# Altium schematic sheet Regulators_block.SchDoc
size A3
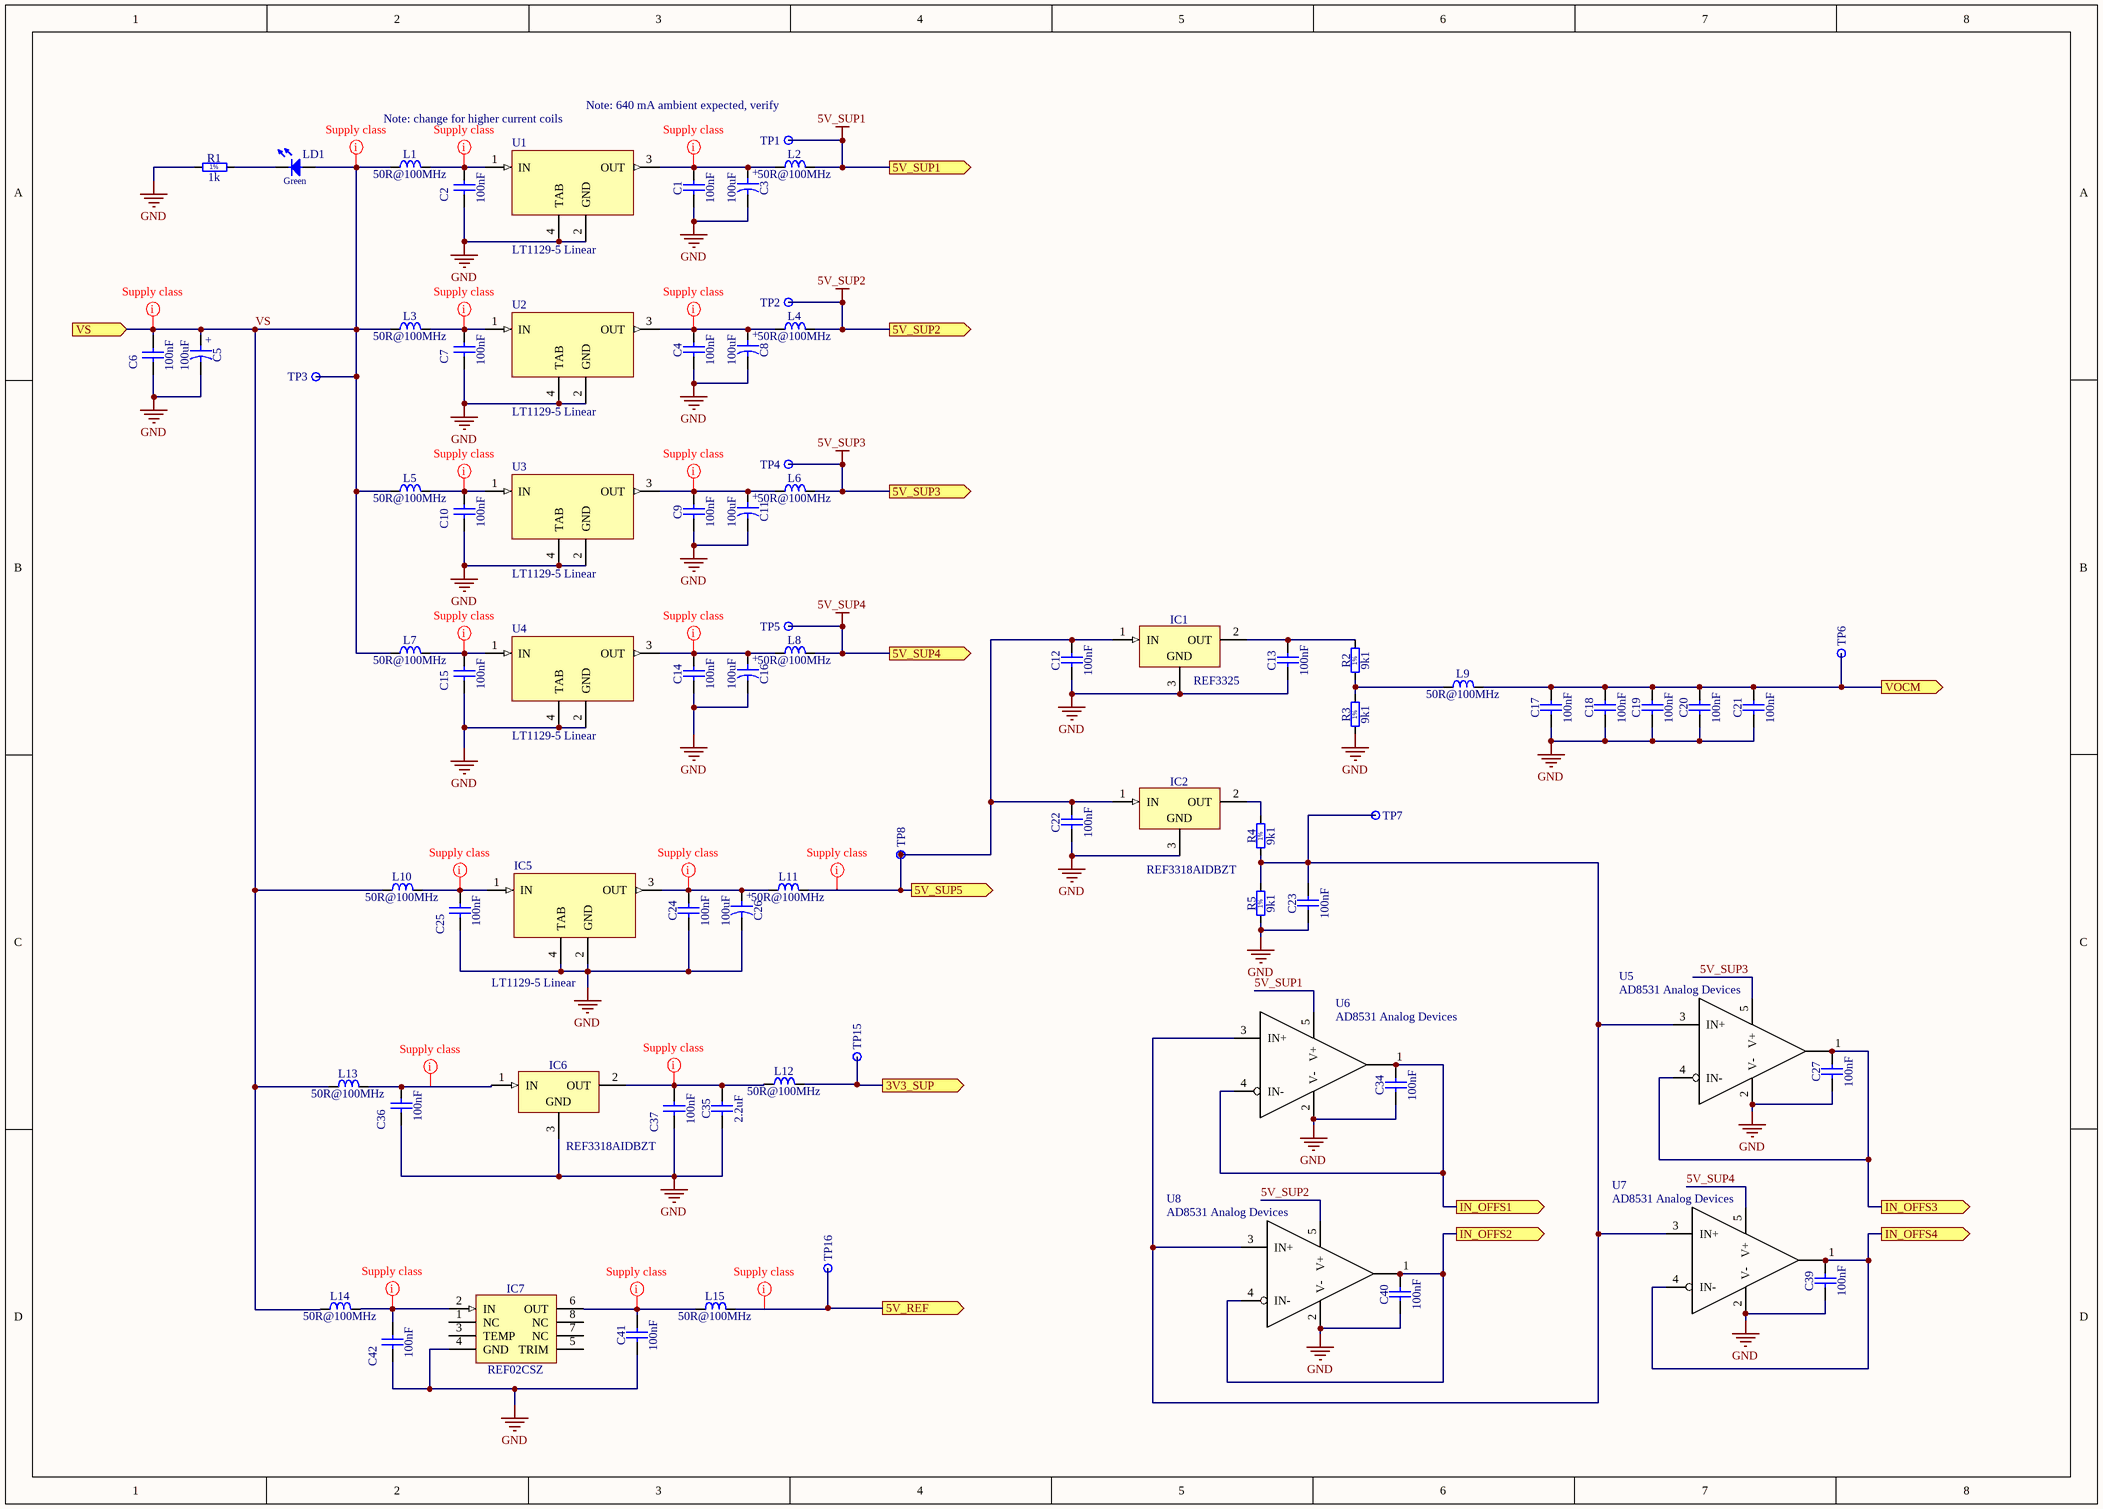
[diagram p0: Regulators_block.SchDoc]

## Parts
C1  100nF  [CAPC2012X135N]
C2  100nF  [CAPC2012X135N]
C3  100uF  [CAPAE660X540N]
C4  100nF  [CAPC2012X135N]
C5  100uF  [CAPAE660X540N]
C6  100nF  [CAPC2012X135N]
C7  100nF  [CAPC2012X135N]
C8  100uF  [CAPAE660X540N]
C9  100nF  [CAPC2012X135N]
C10  100nF  [CAPC2012X135N]
C11  100uF  [CAPAE660X540N]
C12  100nF  [CAPC2012X135N]
C13  100nF  [CAPC2012X135N]
C14  100nF  [CAPC2012X135N]
C15  100nF  [CAPC2012X135N]
C16  100uF  [CAPAE660X540N]
C17  100nF  [CAPC2012X135N]
C18  100nF  [CAPC2012X135N]
C19  100nF  [CAPC2012X135N]
C20  100nF  [CAPC2012X135N]
C21  100nF  [CAPC2012X135N]
C22  100nF  [CAPC2012X135N]
C23  100nF  [CAPC2012X135N]
C24  100nF  [CAPC2012X135N]
C25  100nF  [CAPC2012X135N]
C26  100uF  [CAPAE660X540N]
C27  100nF  [CAPC2012X135N]
C34  100nF  [CAPC2012X135N]
C35  2.2uF  [CAPC2012X135N]
C36  100nF  [CAPC2012X135N]
C37  100nF  [CAPC2012X135N]
C39  100nF  [CAPC2012X135N]
C40  100nF  [CAPC2012X135N]
C41  100nF  [CAPC2012X135N]
C42  100nF  [CAPC2012X135N]
IC1  REF3325  [SOT95P237X112-3N]
IC2  REF3318AIDBZT  [SOT95P237X112-3N]
IC5  LT1129-5 Linear  [SOT230P700X175-4N]
IC6  REF3318AIDBZT  [SOT95P237X112-3N]
IC7  REF02CSZ  [SOIC127P600X175-8N]
L1  50R@100MHz  [IND_MURATA_BLM31PG]
L2  50R@100MHz  [IND_MURATA_BLM31PG]
L3  50R@100MHz  [IND_MURATA_BLM31PG]
L4  50R@100MHz  [IND_MURATA_BLM31PG]
L5  50R@100MHz  [IND_MURATA_BLM31PG]
L6  50R@100MHz  [IND_MURATA_BLM31PG]
L7  50R@100MHz  [IND_MURATA_BLM31PG]
L8  50R@100MHz  [IND_MURATA_BLM31PG]
L9  50R@100MHz  [IND_MURATA_BLM31PG]
L10  50R@100MHz  [IND_MURATA_BLM31PG]
L11  50R@100MHz  [IND_MURATA_BLM31PG]
L12  50R@100MHz  [IND_MURATA_BLM31PG]
L13  50R@100MHz  [IND_MURATA_BLM31PG]
L14  50R@100MHz  [IND_MURATA_BLM31PG]
L15  50R@100MHz  [IND_MURATA_BLM31PG]
LD1  Green  [LED_OSRAM_LGR971]  (value not drawn)
R1  1k  [RESC2012X60N]
R2  9k1  [RESC2012X60N]
R3  9k1  [RESC2012X60N]
R4  9k1  [RESC2012X60N]
R5  9k1  [RESC2012X60N]
TP1  Test Point  [VERO_20-313145]  (value not drawn)
TP2  Test Point  [VERO_20-313145]  (value not drawn)
TP3  Test Point  [VERO_20-313145]  (value not drawn)
TP4  Test Point  [VERO_20-313145]  (value not drawn)
TP5  Test Point  [VERO_20-313145]  (value not drawn)
TP6  Test Point  [VERO_20-313145]  (value not drawn)
TP7  Test Point  [VERO_20-313145]  (value not drawn)
TP8  Test Point  [VERO_20-2136]  (value not drawn)
TP15  Test Point  [VERO_20-2136]  (value not drawn)
TP16  Test Point  [VERO_20-2136]  (value not drawn)
U1  LT1129-5 Linear  [SOT230P700X175-4N]
U2  LT1129-5 Linear  [SOT230P700X175-4N]
U3  LT1129-5 Linear  [SOT230P700X175-4N]
U4  LT1129-5 Linear  [SOT230P700X175-4N]
U5  AD8531 Analog Devices  [SOT95P285X145-5N]
U6  AD8531 Analog Devices  [SOT95P285X145-5N]
U7  AD8531 Analog Devices  [SOT95P285X145-5N]
U8  AD8531 Analog Devices  [SOT95P285X145-5N]

## Ports
3V3_SUP (out), 5V_REF (out), 5V_SUP1 (out), 5V_SUP2 (out), 5V_SUP3 (out), 5V_SUP4 (out), 5V_SUP5 (out), IN_OFFS1 (out), IN_OFFS2 (out), IN_OFFS3 (out), IN_OFFS4 (out), VOCM (out), VS (in)

## Nets
5V_SUP1: L2.2 TP1.1 U6.5(V+) ; port 5V_SUP1
5V_SUP2: L4.2 TP2.1 U8.5(V+) ; port 5V_SUP2
5V_SUP3: L6.2 TP4.1 U5.5(V+) ; port 5V_SUP3
5V_SUP4: L8.2 TP5.1 U7.5(V+) ; port 5V_SUP4
GND: C1.1 C2.1 C3.2 C4.1 C5.2 C6.1 C7.1 C8.2 C9.1 C10.1 C11.2 C12.1 C13.1 C14.1 C15.1 C16.2 C17.1 C18.1 C19.1 C20.1 C21.1 C22.1 C23.1 C24.1 C25.1 C26.2 C27.1 C34.1 C35.1 C36.1 C37.1 C39.1 C40.1 C41.1 C42.1 IC1.3(GND) IC2.3(GND) IC5.2(GND) IC5.4(TAB) IC6.3(GND) IC7.4(GND) R1.1 R3.1 R5.1 U1.2(GND) U1.4(TAB) U2.2(GND) U2.4(TAB) U3.2(GND) U3.4(TAB) U4.2(GND) U4.4(TAB) U5.2(V-) U6.2(V-) U7.2(V-) U8.2(V-)
3V3_SUP: L12.2 TP15.1 ; port 3V3_SUP
5V_REF: L15.2 TP16.1 ; port 5V_REF
5V_SUP5: C12.2 C22.2 IC1.1(IN) IC2.1(IN) L11.2 TP8.1 ; port 5V_SUP5
IN_OFFS1: C34.2 U6.1(OUT+) U6.4(IN-) ; port IN_OFFS1
IN_OFFS2: C40.2 U8.1(OUT+) U8.4(IN-) ; port IN_OFFS2
IN_OFFS3: C27.2 U5.1(OUT+) U5.4(IN-) ; port IN_OFFS3
IN_OFFS4: C39.2 U7.1(OUT+) U7.4(IN-) ; port IN_OFFS4
VOCM: C17.2 C18.2 C19.2 C20.2 C21.2 L9.2 TP6.1 ; port VOCM
VS: C5.1 C6.2 L1.1 L3.1 L5.1 L7.1 L10.1 L13.1 L14.1 LD1.2(A) TP3.1 ; port VS
NetC1_2: C1.2 C3.1 L2.1 U1.3(OUT)
NetC2_2: C2.2 L1.2 U1.1(IN)
NetC4_2: C4.2 C8.1 L4.1 U2.3(OUT)
NetC7_2: C7.2 L3.2 U2.1(IN)
NetC9_2: C9.2 C11.1 L6.1 U3.3(OUT)
NetC10_2: C10.2 L5.2 U3.1(IN)
NetC13_2: C13.2 IC1.2(OUT) R2.2
NetC14_2: C14.2 C16.1 L8.1 U4.3(OUT)
NetC15_2: C15.2 L7.2 U4.1(IN)
NetC23_2: C23.2 R4.1 R5.2 TP7.1 U5.3(IN+) U6.3(IN+) U7.3(IN+) U8.3(IN+)
NetC24_2: C24.2 C26.1 IC5.3(OUT) L11.1
NetC25_2: C25.2 IC5.1(IN) L10.2
NetC35_2: C35.2 C37.2 IC6.2(OUT) L12.1
NetC36_2: C36.2 IC6.1(IN) L13.2
NetC41_2: C41.2 IC7.6(OUT) L15.1
NetC42_2: C42.2 IC7.2(IN) L14.2
NetIC2_2: IC2.2(OUT) R4.2
NetL9_1: L9.1 R2.1 R3.2
NetLD1_1: LD1.1(C) R1.2

Not connected (* = marked no-connect by the designer): IC7 1(NC) 3(TEMP) 5(TRIM) 7(NC) 8(NC)

## Layout directives
net class Supply: 5V_REF, 5V_SUP5, NetC1_2, NetC2_2, NetC4_2, NetC7_2, NetC9_2, NetC10_2, NetC14_2, NetC15_2, NetC24_2, NetC25_2, NetC35_2, NetC36_2, NetC41_2, NetC42_2, VS

## Notes on the sheet
- (near TP1) Note: 640 mA ambient expected, verify
- Note: change for higher current coils
- (in symbol CAE660-540_100UF_16V_20%) +
- (in symbol R0805_1K_1%_0.125W_100PPM) 1%
- (in symbol R0805_9K1_1%_0.125W_100PPM) 1%

## Library data of the parts
C1 C2 C4 C6 C7 C9 C10 C12-C15 C17-C25 C27 C34 C36 C37 C39-C42 = CC0805_100NF_50V_10%_X7R: Non-polarised capacitor; Part Description: SMD Multilayer Chip Ceramic Capacitor; Manufacturer: GENERIC; Manufacturer1 Part Number: C2012X7R1H104K085AA; Voltage: 50V; TC: X7R; Tolerance: ±10%; Part Number: CC0805_100NF_50V_10%_X7R; Component Kind: Standard; Component Type: Standard; Pin Count: 2; Value: 100nF; Status: Preferred; Manufacturer Part Number: CC0805_100NF_50V_10%_X7R; Case: 0805; Mounted: Yes; Socket: No; SMD: Yes; Sense: No; Manufacturer1 Example: TDK; Manufacturer1 ComponentHeight: 1mm; HelpURL: \\cern.ch\dfs\Applications\Altium\Datasheets\CC0805_X7R_TDK_C.pdf; Author: CERN DEM JLC; CreateDate: 03.12.2007; LatestRevisionDate: 22.04.2015
C3 C5 C8 C11 C16 C26 = CAE660-540_100UF_16V_20%: Polarised capacitor; Part Description: Aluminum Electrolytic SMT Capacitor; Manufacturer: PANASONIC; Manufacturer Part Number: EEEFK1C101AP; Voltage: 16V; Tolerance: ±20%; Part Number: CAE660-540_100UF_16V_20%; Component Kind: Standard; Component Type: Standard; Pin Count: 2; Value: 100uF; Status: Not Recommended; Case: D; Mounted: Yes; Socket: No; SMD: Yes; Sense: No; ComponentHeight: 5.8mm; HelpURL: \\cern.ch\dfs\Applications\Altium\Datasheets\CAE_PANASONIC_FK.pdf; Author: CERN DEM JLC; CreateDate: 03.12.2007; LatestRevisionDate: 05.11.2014
C35 = CC0805_2.2UF_16V_10%_X7R: Non-polarised capacitor; Part Description: SMD Multilayer Chip Ceramic Capacitor; Manufacturer: GENERIC; Manufacturer1 Part Number: GRM21BF51C225ZA01L; Voltage: 16V; TC: X7R; Tolerance: ±10%; Part Number: CC0805_2.2UF_16V_10%_X7R; Component Kind: Standard; Component Type: Standard; Pin Count: 2; Value: 2.2uF; Status: Preferred; Manufacturer Part Number: CC0805_2.2UF_16V_10%_X7R; Case: 0805; Mounted: Yes; Socket: No; SMD: Yes; Sense: No; Manufacturer1 Example: MURATA; Manufacturer1 ComponentHeight: 1.5mm; HelpURL: \\cern.ch\dfs\Applications\Altium\Datasheets\CC0805_X7R_MURATA_GRM.pdf; Author: CERN DEM JLC; CreateDate: 03.12.2007; LatestRevisionDate: 18.09.2014
IC1 IC2 IC6 = REF3318AIDBZT: 3-Terminal Regulator 1=IN 2=OUT 3=GND; Part Description: 1.8V, 30ppm/°C Drift, 3.9uA, Voltage Reference; Manufacturer: TEXAS INSTRUMENTS; PressFit: No; Bonding: No; Component Kind: Standard; Component Type: Standard; PackageDescription: SOT, 0.95mm, pitch; 3 pin,1.30mm W X 2.92mm L X 1.12mm H body, IPC Medium Density; Pin Count: 3; Case: SOT23; Mounted: Yes; Socket: No; SMD: Yes; Sense: No; ComponentHeight: 1.12mm; HelpURL: \\cern.ch\dfs\Applications\Altium\Datasheets\REF3318AIDBZT.pdf; Author: CERN DEM JLC; CreateDate: 20.06.2011; LatestRevisionDate: 20.06.2011
  IC1: Part Number: REF3325; Device: REF3325; Manufacturer Part Number: REF3325
  IC2 IC6: Part Number: REF3318AIDBZT; Device: REF3318AIDBZT; Manufacturer Part Number: REF3318AIDBZT
IC5 U1-U4 = LT1129-5: Name: LT1129-5; Manufacturer: Linear
IC7 = REF02CSZ: Precision Voltage Reference/Temperature Transducer; Part Description: 5V Precision Voltage Reference/Temperature Transducer; Manufacturer: ANALOG DEVICES; PressFit: No; Bonding: No; Part Number: REF02CSZ; Component Kind: Standard; Component Type: Standard; Device: REF02CSZ; PackageDescription: SOIC 8, Pitch 1.27mm, Body 4x5mm, IPC Medium Density; Manufacturer Part Number: REF02CSZ; Pin Count: 8; Case: SOIC8; Mounted: Yes; Socket: No; SMD: Yes; Sense: No; ComponentHeight: 1.75mm; HelpURL: \\cern.ch\dfs\Applications\Altium\Datasheets\REF02CSZ.pdf; Author: CERN DEM JLC; CreateDate: 29.05.2008; LatestRevisionDate: 29.05.2008
L1-L15 = IND1206_MURATA_BLM31PG500SN1: Inductor; Part Description: SMD EMIFIL Chip Ferrite Bead; Manufacturer: MURATA; Power: 3.5A; Resistance: 0.015R; Part Number: IND1206_MURATA_BLM31PG500SN1; Component Kind: Standard; Component Type: Standard; Pin Count: 2; Value: 50R@100MHz; Status: None; Manufacturer Part Number: BLM31PG500SN1; Case: 1206; Mounted: Yes; Socket: No; SMD: Yes; Sense: No; ComponentHeight: 1.3mm; HelpURL: \\cern.ch\dfs\Applications\Altium\Datasheets\IND1206_MURATA_BLM31P.pdf; Author: CERN DEM JLC; CreateDate: 05.12.2013; LatestRevisionDate: 05.12.2013
LD1 = LED_OSRAM_LGR971: LED Green 1C 2A; Part Description: Surface Mount Green LED (0805 Case); Manufacturer: OSRAM; Manufacturer Part Number: LGR971; PressFit: No; Bonding: No; Part Number: LED_OSRAM_LGR971; Component Kind: Standard; Component Type: Standard; Color: Green; PackageDescription: Green Chip LED, 2-Leads, Body 2.0x1.25mm, IPC Medium Density; Pin Count: 2; Case: 0805; Mounted: Yes; Socket: No; SMD: Yes; Sense: No; ComponentHeight: 0.9mm; HelpURL: \\cern.ch\dfs\Applications\Altium\Datasheets\LED_OSRAM_LGR971.pdf; Author: CERN DEM JLC; CreateDate: 28.01.2009; LatestRevisionDate: 17.03.2010
R1 = R0805_1K_1%_0.125W_100PPM: Resistor - 1%; Part Description: General Purpose Thick Film Chip Resistor; Manufacturer: GENERIC; Manufacturer1 Part Number: NRC10F1001TRF; Power: 0.125W; TC: ±100ppm/°C; PressFit: No; Part Number: R0805_1K_1%_0.125W_100PPM; Component Kind: Standard; Component Type: Standard; Pin Count: 2; Value: 1k; Status: Preferred; Tolerance: ±1%; Manufacturer Part Number: R0805_1K_1%_0.125W_100PPM; Case: 0805; Mounted: Yes; Sense: No; Socket: No; SMD: Yes; Manufacturer1 Example: NIC COMPONENT; Manufacturer1 ComponentHeight: 0.6mm; HelpURL: \\cern.ch\dfs\Applications\Altium\Datasheets\R0805_NIC_NRC.pdf; Author: CERN DEM JLC; CreateDate: 03.12.2007; LatestRevisionDate: 13.03.2008
R2-R5 = R0805_9K1_1%_0.125W_100PPM: Resistor - 1%; Part Description: General Purpose Thick Film Chip Resistor; Manufacturer: GENERIC; Manufacturer1 Part Number: NRC10F9101TRF; Power: 0.125W; TC: ±100ppm/°C; PressFit: No; Part Number: R0805_9K1_1%_0.125W_100PPM; Component Kind: Standard; Component Type: Standard; Pin Count: 2; Value: 9k1; Status: Preferred; Tolerance: ±1%; Manufacturer Part Number: R0805_9K1_1%_0.125W_100PPM; Case: 0805; Mounted: Yes; Sense: No; Socket: No; SMD: Yes; Manufacturer1 Example: NIC COMPONENT; Manufacturer1 ComponentHeight: 0.6mm; HelpURL: \\cern.ch\dfs\Applications\Altium\Datasheets\R0805_NIC_NRC.pdf; Author: CERN DEM JLC; CreateDate: 03.12.2007; LatestRevisionDate: 13.03.2008
TP1-TP7 = VERO_20-313145: Part Description: Black Bead PCB Terminal Test Pin for 2.4mm PCB Thickness (1.32mm Hole); Manufacturer: VERO TECHNOLOGIES; PressFit: No; Part Number: VERO_20-313145; Component Kind: Standard; Component Type: Standard; Pin Count: 1; Family: Test Point; Mounted: Yes; Socket: No; SMD: No; Sense: No; Status: None; Manufacturer Part Number: 20-313145; ComponentHeight: 5.3mm; HelpURL: \\cern.ch\dfs\Applications\Altium\Datasheets\VERO_20-313145.pdf; Author: CERN DEM JLC; CreateDate: 15.07.2013; LatestRevisionDate: 15.07.2013
TP8 TP15 TP16 = VERO_20-2136: Part Description: Black Bead PCB Terminal Test Pin for 1.6mm PCB Thickness (1.32mm Hole); Manufacturer: VERO TECHNOLOGIES; PressFit: No; Part Number: VERO_20-2136; Component Kind: Standard; Component Type: Standard; Pin Count: 1; Family: Test Point; Mounted: Yes; Socket: No; SMD: No; Sense: No; Status: None; Manufacturer Part Number: 20-2136; ComponentHeight: 5.3mm; HelpURL: \\cern.ch\dfs\Applications\Altium\Datasheets\VERO_20-2136.pdf; Author: CERN DEM JLC; CreateDate: 21.07.2008; LatestRevisionDate: 15.07.2013
U5-U8 = AD8531: Manufacturer: Analog Devices; Name: AD8531